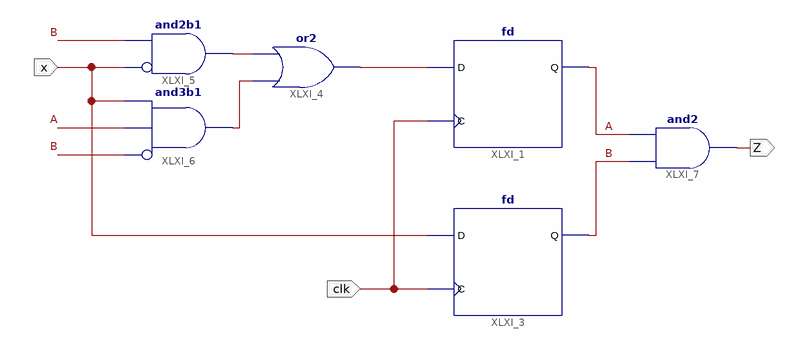
[diagram p0: schematic sheet 1]
// Xilinx ISE schematic FSM_Moore.sch (xc9500) as structural Verilog: 6 symbols, 3 ports
module FSM_Moore (
  input  x,
  input  clk,
  output Z
);

  wire A, B, XLXN_8, XLXN_9, XLXN_10;

  fd XLXI_1 (.C(clk), .D(XLXN_8), .Q(A));
  fd XLXI_3 (.C(clk), .D(x), .Q(B));
  or XLXI_4 (XLXN_8, XLXN_10, XLXN_9);
  and XLXI_5 (XLXN_9, ~x, B);  // and2b1
  and XLXI_6 (XLXN_10, ~B, A, x);  // and3b1
  and XLXI_7 (Z, B, A);
endmodule
